# EAGLE design syringe board 1.4 (EAGLE 7.7.0)
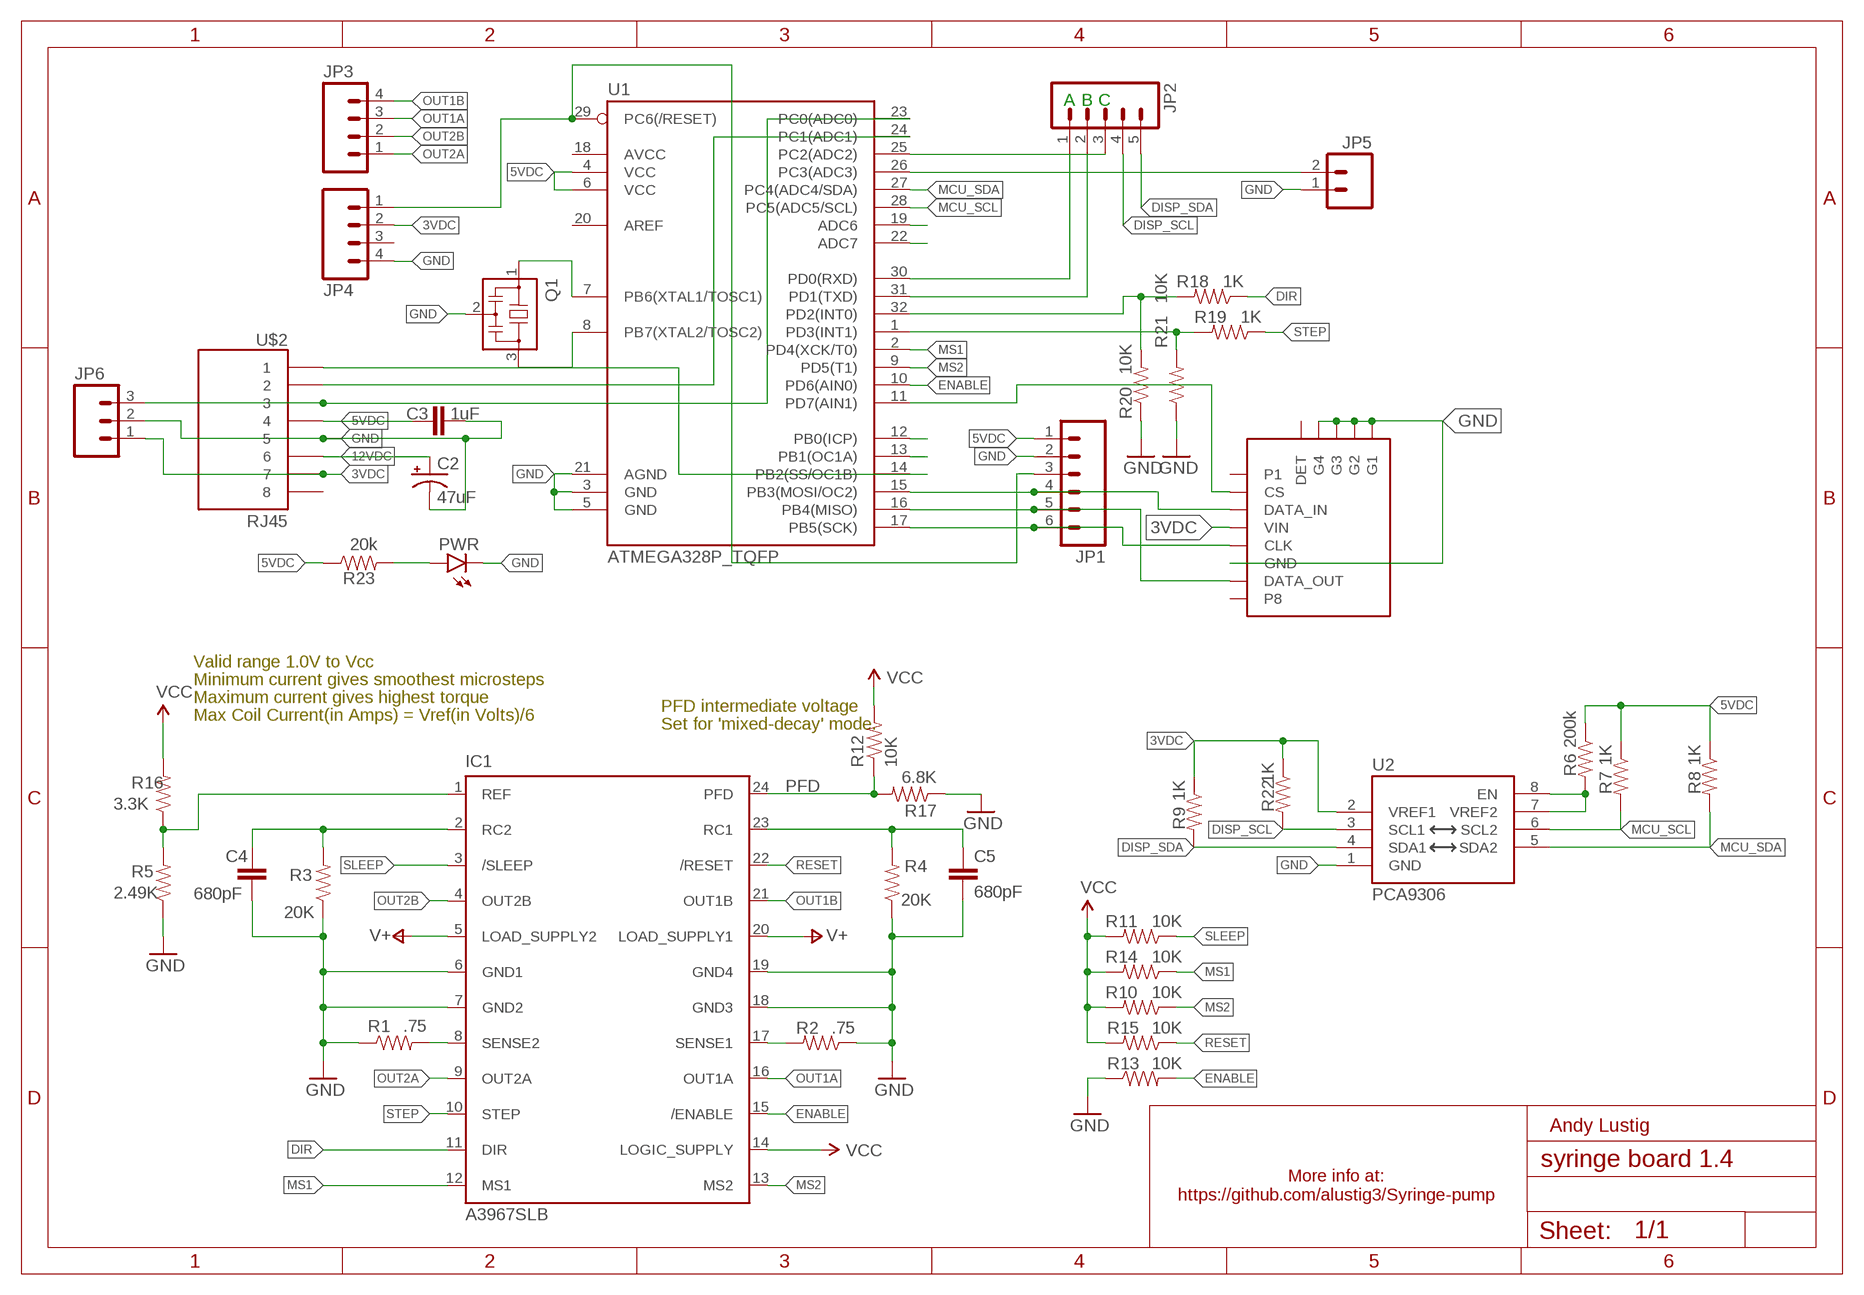
[diagram p0: schematic, sheet 1]

## Parts
C2  47uF  CPOL-USD  [PANASONIC_D]
C3  1uF  CAP0603-CAP  [0603-CAP]
C4  680pF  CAP0603-CAP  [0603-CAP]
C5  680pF  CAP0603-CAP  [0603-CAP]
IC1  A3967SLB  [SO24W]
JP1  M06NO_SILK_FEMALE_PTH  [1X06_NO_SILK]
JP2  M05NO_SILK  [1X05_NO_SILK]
JP3  M041X04_NO_SILK  [1X04_NO_SILK]
JP4  M04NO_SILK_ALL_ROUND  [1X04_NO_SILK_ALL_ROUND]
JP5  M021X02_NO_SILK  [1X02_NO_SILK]
JP6  M031X03_NO_SILK  [1X03_NO_SILK]
PWR  LED0603  [LED-0603]
Q1  RESONATOR_CSTCE_V  [CSTCE_V]
R1  .75  RESISTOR0805-RES  [0805]
R2  .75  RESISTOR0805-RES  [0805]
R3  20K  RESISTOR0603  [0603-RES]
R4  20K  RESISTOR0603  [0603-RES]
R5  2.49K  RESISTOR0603  [0603-RES]
R6  200k  RESISTOR0603  [0603-RES]
R7  1K  RESISTOR0603  [0603-RES]
R8  1K  RESISTOR0603  [0603-RES]
R9  1K  RESISTOR0603  [0603-RES]
R10  10K  RESISTOR0603  [0603-RES]
R11  10K  RESISTOR0603  [0603-RES]
R12  10K  RESISTOR0603  [0603-RES]
R13  10K  RESISTOR0603  [0603-RES]
R14  10K  RESISTOR0603  [0603-RES]
R15  10K  RESISTOR0603  [0603-RES]
R16  3.3K  RESISTOR0603  [0603-RES]
R17  6.8K  RESISTOR0603  [0603-RES]
R18  1K  RESISTOR0603  [0603-RES]
R19  1K  RESISTOR0603  [0603-RES]
R20  10K  RESISTOR0603  [0603-RES]
R21  10K  RESISTOR0603  [0603-RES]
R22  1K  RESISTOR0603  [0603-RES]
R23  20k  RESISTOR0603  [0603-RES]
U1  ATMEGA328P_TQFP  [TQFP32-08]
U2  PCA9306  [PSOP-8]
U$1  MICROSD_SOCKET  [MICROSD]
U$2  RJ45  [RJ45-8]

## Nets
3VDC: JP4.2 JP6.1 R9.1 R22.1 U2.2(VREF1) U$1.P4(VIN) U$2.7
5VDC: C3.1 IC1.14(LOGIC_SUPPLY) JP1.1 R6.1 R7.1 R8.1 R10.2 R11.2 R12.2 R14.2 R15.2 R16.2 R23.1 U1.4(VCC) U1.6(VCC) U$2.4 ; supply symbol labelled VCC
12VDC: C2.+ IC1.5(LOAD_SUPPLY2) IC1.20(LOAD_SUPPLY1) U$2.6 ; supply symbol labelled V+
DIR: IC1.11(DIR) R18.1
DIR_IN: R18.2 R20.2 U1.32(PD2(INT0))
DISP_SCL: JP2.4 R22.2 U2.3(SCL1)
DISP_SDA: JP2.5 R9.2 U2.4(SDA1)
ENABLE: IC1.15(/ENABLE) R13.2 U1.10(PD6(AIN0))
GND: C2.- C3.2 C4.2 C5.2 IC1.6(GND1) IC1.7(GND2) IC1.18(GND3) IC1.19(GND4) JP1.2 JP4.4 JP5.1 JP6.2 PWR.C Q1.2 R1.1 R2.1 R3.1 R4.1 R5.1 R13.1 R17.1 R20.1 R21.1 U1.3(GND) U1.5(GND) U1.21(AGND) U2.1(GND) U$1.G1 U$1.G2 U$1.G3 U$1.G4 U$1.P6(GND) U$2.5
MCU_SCL: R7.2 U1.28(PC5(ADC5/SCL)) U2.6(SCL2)
MCU_SDA: R8.2 U1.27(PC4(ADC4/SDA)) U2.5(SDA2)
MISO: JP1.5 U1.16(PB4(MISO)) U$1.P7(DATA_OUT)
MOSI: JP1.4 U1.15(PB3(MOSI/OC2)) U$1.P3(DATA_IN)
MS1: IC1.12(MS1) R14.1 U1.2(PD4(XCK/T0))
MS2: IC1.13(MS2) R10.1 U1.9(PD5(T1))
N$1: IC1.8(SENSE2) R1.2
N$2: Q1.1 U1.7(PB6(XTAL1/TOSC1))
N$3: IC1.17(SENSE1) R2.2
N$4: Q1.3 U1.8(PB7(XTAL2/TOSC2))
N$5: C4.1 IC1.2(RC2) R3.2
N$6: R6.2 U2.7(VREF2) U2.8(EN)
N$7: C5.1 IC1.23(RC1) R4.2
N$8: PWR.A R23.2
N$9: U1.11(PD7(AIN1)) U$1.P2(CS)
N$11: U1.13(PB1(OC1A))
N$12: JP6.3 U1.23(PC0(ADC0)) U$2.3
N$13: U1.12(PB0(ICP))
N$14: U1.22(ADC7)
N$15: JP2.1 U1.30(PD0(RXD))
N$16: JP2.2 U1.31(PD1(TXD))
N$17: JP2.3 U1.25(PC2(ADC2))
N$18: U1.19(ADC6)
N$19: JP5.2 U1.26(PC3(ADC3))
N$20: U1.24(PC1(ADC1)) U$2.2
N$21: U1.14(PB2(SS/OC1B)) U$2.1
OUT1A: IC1.16(OUT1A) JP3.3
OUT1B: IC1.21(OUT1B) JP3.4
OUT2A: IC1.9(OUT2A) JP3.1
OUT2B: IC1.4(OUT2B) JP3.2
PFD: IC1.24(PFD) R12.1 R17.2
RESET: IC1.22(/RESET) R15.1
RST: JP1.3 JP4.1 U1.29(PC6(/RESET))
SCK: JP1.6 U1.17(PB5(SCK)) U$1.P5(CLK)
SLEEP: IC1.3(/SLEEP) R11.1
STEP: IC1.10(STEP) R19.1
STEP_IN: R19.2 R21.2 U1.1(PD3(INT1))
VREF: IC1.1(REF) R5.2 R16.1
Unconnected: JP4.3 U1.18(AVCC) U1.20(AREF) U$1.G5(DET) U$1.P1 U$1.P8 U$2.8

## Notes on the sheet
- A | B | C
- Valid range 1.0V to Vcc
- Minimum current gives smoothest microsteps
- Maximum current gives highest torque
- PFD intermediate voltage
- Max Coil Current(in Amps) = Vref(in Volts)/6
- Set for 'mixed-decay' mode.
- Andy Lustig
- More info at:
  https://github.com/alustig3/Syringe-pump

## Library data of the parts
C2 = adafruit:CPOL-US: POLARIZED CAPACITOR, American symbol
C3-C5 = SparkFun-Capacitors:CAP: Capacitor Standard 0603 ceramic capacitor, and 0.1" leaded capacitor.
IC1 = Allegro:A3967SLB: ANALOG DEVICES
JP1 = SparkFun-Connectors:M06: Header 6 Standard 6-pin 0.1" header. Use with straight break away headers (SKU : PRT-00116), right angle break away headers (PRT-00553), swiss pins (PRT-00743), machine pins (PRT-00117), and female headers (PRT-00115). Molex polarized connector foot print use with SKU : PRT-08094 with associated crimp pins and housings. NOTES ON THE VARIANTS LOCK and LOCK_LONGPADS... This footprint was designed to help hold the alignment of a through-hole component (i.e. 6-pin header) while soldering it into place. You may notice that each hole has been shifted either up or down by 0.005 of an inch from it's more standard position (which is a perfectly straight line). This slight alteration caused the pins (the squares in the middle) to touch the edges of the holes. Because they are alternating, it causes a "brace" to hold the component in place. 0.005 has proven to be the perfect amount of "off-center" position when using our standard breakaway headers. Although looks a little odd when you look at the bare footprint, once you have a header in there, the alteration is very hard to notice. Also,if you push a header all the way into place, it is covered up entirely on the bottom side. This idea of altering the position of holes to aid alignment will be further integrated into the Sparkfun Library for other footprints. It can help hold any component with 3 or more connection pins.; PROD_ID: CONN-08437
JP2 = SparkFun-Connectors:M05: Header 5 Standard 5-pin 0.1" header. Use with straight break away headers (SKU : PRT-00116), right angle break away headers (PRT-00553), swiss pins (PRT-00743), machine pins (PRT-00117), and female headers (PRT-00115). Molex polarized connector foot print use with SKU : PRT-08230 with associated crimp pins and housings.
JP3 = SparkFun:M04: Header 4 Standard 4-pin 0.1" header. Use with straight break away headers (SKU : PRT-00116), right angle break away headers (PRT-00553), swiss pins (PRT-00743), machine pins (PRT-00117), and female headers (PRT-00115). Molex polarized connector foot print use with SKU : PRT-08231 with associated ...
JP4 = SparkFun-Connectors:M04: Header 4 Standard 4-pin 0.1" header. Use with straight break away headers (SKU : PRT-00116), right angle break away headers (PRT-00553), swiss pins (PRT-00743), machine pins (PRT-00117), and female headers (PRT-00115). Molex polarized connector foot print use with SKU : PRT-08231 with associated ...
JP5 = SparkFun-Connectors:M02: Standard 2-pin 0.1" header. Use with - straight break away headers ( PRT-00116) - right angle break away headers (PRT-00553) - swiss pins (PRT-00743) - machine pins (PRT-00117) - female headers (PRT-00115) Molex polarized connector foot print use with: PRT-08233 with associated crimp pins and housings. 2.54_SCREWTERM for use with PRT-10571. 3.5mm Screw Terminal footprints for PRT-08084 5mm Screw Terminal footprints for use with PRT-08432
JP6 = SparkFun-Connectors:M03: Header 3 Standard 3-pin 0.1" header. Use with straight break away headers (SKU : PRT-00116), right angle break away headers (PRT-00553), swiss pins (PRT-00743), machine pins (PRT-00117), and female headers (PRT-00115). Molex polarized connector foot print use with SKU : PRT-08232 with associated crimp pins and housings.
PWR = Andy-library:LED: LEDs Standard schematic elements and footprints for 5mm, 3mm, 1206, and 0603 sized LEDs. 5mm - Spark Fun Electronics SKU : COM-00529 (and others)
Q1 = Andy-library:RESONATOR: 16 MHz Resonator(Murata p/n CSTCE16M0V53-R0) Digikey: 490-1198-1-ND <http://www.digikey.com/product-search/en?keywords=490-1198-1-nd>
R1-R23 = SparkFun-Resistors:RESISTOR: Resistor Basic schematic elements and footprints for 0603, 1206, and PTH resistors.
U1 = SparkFun-DigitalIC:ATMEGA328P_TQFP; PROD_ID: IC-09069
U2 = SparkFun-DigitalIC:PCA9306: Bidirectional I2C level shifter. NOT compatible with all available part number pinout schemes- DOUBLE CHECK!!!; PROD_ID: IC-10023
U$1 = Andy-library:MICROSD_SOCKET: Molex push-pull micro SD card connector Digikey: WM9731CT-ND <http://www.digikey.com/product-search/en?keywords=wm9731ct>
U$2 = Andy-library:RJ45

## Board
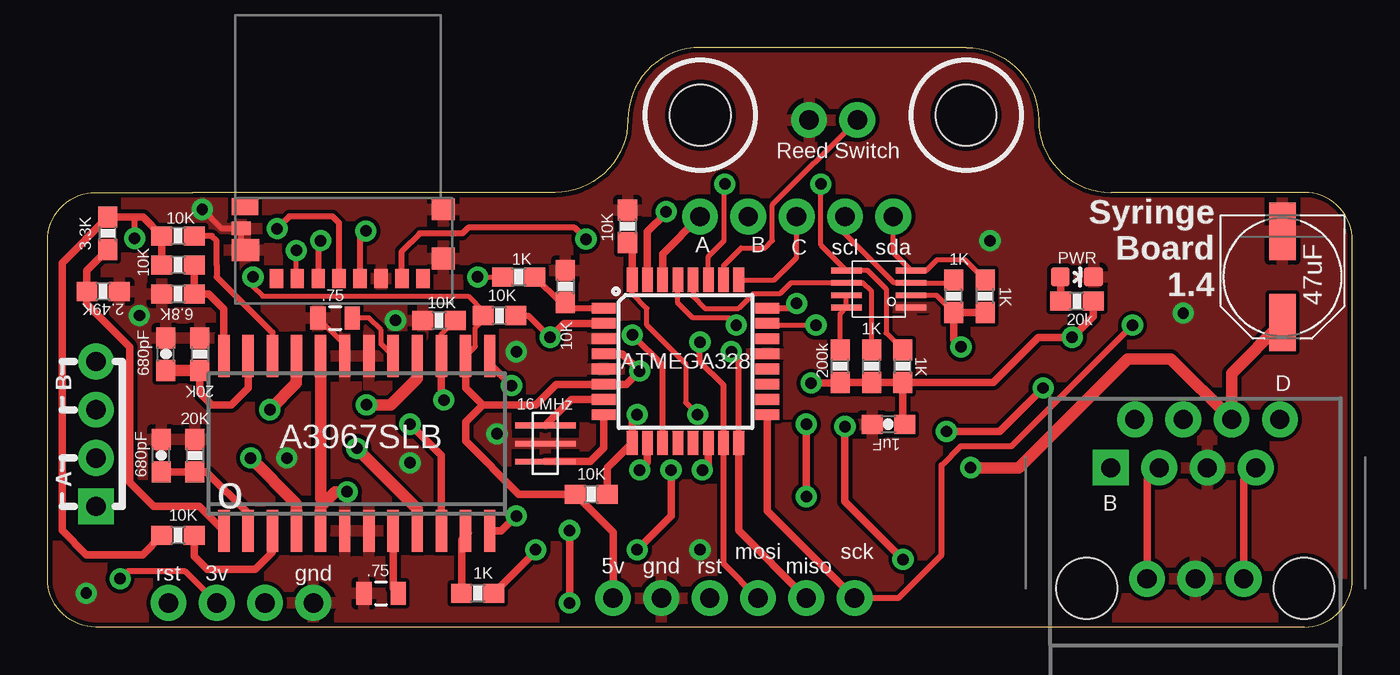
[diagram p1: board, top side]
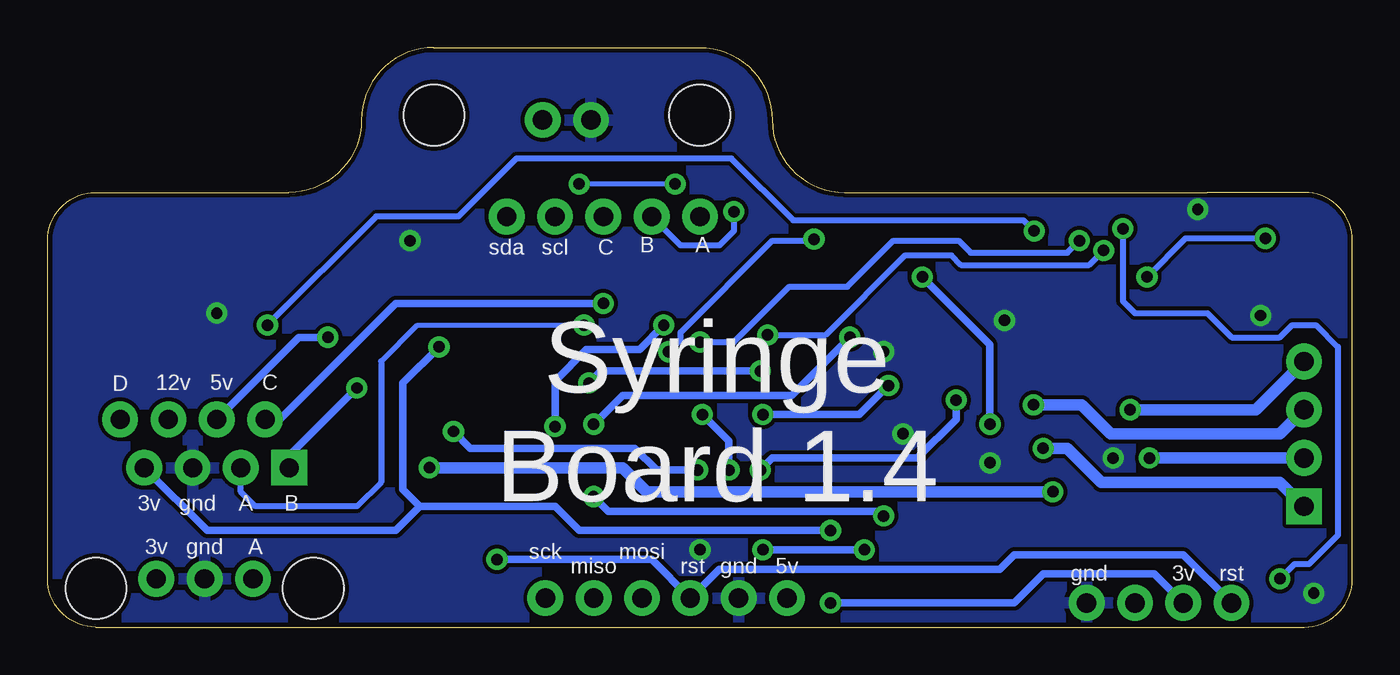
[diagram p2: board, bottom side, seen from below]

Size 68.58 x 30.48 mm. Coordinates in mm from the lower left corner, seen from the top.
Outline: 7.64,22.86 26.68,22.86 arc90 30.5,26.67 arc-90 34.3,30.48 48.27,30.48 arc-90 52.09,26.67 arc90 55.9,22.86 66.04,22.86 arc-90 68.58,20.32 68.58,2.54 arc-90 66.04,0 2.54,0 arc-90 0,2.54 0,20.32 arc-90 2.54,22.86 7.62,22.86
Copper layers (1*16): Top 0.035mm / dielectric 1.5mm / Bottom 0.035mm
Design rules "GoldPhoenix_8and8": minimum track width 7mil, minimum drill 15mil, track to track 8mil, track to pad 8mil, pad to pad 8mil, via to via 8mil, smd to smd 8mil, copper to edge 10mil, drill to drill 8mil, minimum pad ring 12mil, minimum via ring 10mil, stop-mask expansion 4mil, vias tented up to drill 25mil, thermal gap 10mil
Holes 3.2 mm at 34.3,26.92 48.27,26.92

### Footprints (pad centres in the part's own frame; a part is rotated, then mirrored left to right if it is on the bottom)
PANASONIC_D = smd 3 x 1.4: + 2.4,0; - -2.4,0
0603-CAP = smd 1.1 x 1: 1 -0.85,0; 2 0.85,0
SO24W = smd 0.6 x 2.2: 1 -6.985,-4.6; 2 -5.715,-4.6; 3 -4.445,-4.6; 4 -3.175,-4.6; 5 -1.905,-4.6; 6 -0.635,-4.6; 7 0.635,-4.6; 8 1.905,-4.6; 9 3.175,-4.6; 10 4.445,-4.6; 11 5.715,-4.6; 12 6.985,-4.6; 13 6.985,4.6; 14 5.715,4.6; 15 4.445,4.6; 16 3.175,4.6; 17 1.905,4.6; 18 0.635,4.6; 19 -0.635,4.6; 20 -1.905,4.6; 21 -3.175,4.6; 22 -4.445,4.6; 23 -5.715,4.6; 24 -6.985,4.6
1X06_NO_SILK = drill 1.016 pad 1.88: 1 0,0; 2 2.54,0; 3 5.08,0; 4 7.62,0; 5 10.16,0; 6 12.7,0
1X05_NO_SILK = drill 1.016 pad 1.88: 1 0,0; 2 2.54,0; 3 5.08,0; 4 7.62,0; 5 10.16,0
1X04_NO_SILK = drill 1.016 pad 1.88 square: 1 0,0 | drill 1.016 pad 1.88: 2 2.54,0; 3 5.08,0; 4 7.62,0
1X04_NO_SILK_ALL_ROUND = drill 1.016 pad 1.88: 1 0,0; 2 2.54,0; 3 5.08,0; 4 7.62,0
1X02_NO_SILK = drill 1.016 pad 1.88: 1 0,0; 2 2.54,0
1X03_NO_SILK = drill 1.016 pad 1.88: 1 0,0; 2 2.54,0; 3 5.08,0
LED-0603 = smd 1 x 1: A 0,-0.877; C 0,0.877
CSTCE_V = smd 0.3 x 3.175: 1 -0.95,0; 2 0,0; 3 0.95,0
0805 = smd 0.8 x 1.2: 1 -0.9,0; 2 0.9,0
0603-RES = smd 1.1 x 1: 1 -0.85,0; 2 0.85,0
TQFP32-08 = smd 1.27 x 0.559: 1 -4.293,2.8; 2 -4.293,2; 3 -4.293,1.2; 4 -4.293,0.4; 5 -4.293,-0.4; 6 -4.293,-1.2; 7 -4.293,-2; 8 -4.293,-2.8; 17 4.293,-2.8; 18 4.293,-2; 19 4.293,-1.2; 20 4.293,-0.4; 21 4.293,0.4; 22 4.293,1.2; 23 4.293,2; 24 4.293,2.8 | smd 0.559 x 1.27: 9 -2.8,-4.293; 10 -2,-4.293; 11 -1.2,-4.293; 12 -0.4,-4.293; 13 0.4,-4.293; 14 1.2,-4.293; 15 2,-4.293; 16 2.8,-4.293; 25 2.8,4.293; 26 2,4.293; 27 1.2,4.293; 28 0.4,4.293; 29 -0.4,4.293; 30 -1.2,4.293; 31 -2,4.293; 32 -2.8,4.293
PSOP-8 = smd 0.3 x 1.6: 1 -0.975,-1.7; 2 -0.325,-1.7; 3 0.325,-1.7; 4 0.975,-1.7; 5 0.975,1.7; 6 0.325,1.7; 7 -0.325,1.7; 8 -0.975,1.7
MICROSD = smd 1.2 x 1.15: G1 -4.925,-2.36; G2 -4.925,-4.95 | smd 1.45 x 1.15: G3 5.475,-2.8 | smd 1 x 0.7: G4 5.7,-3.95 | smd 1.4 x 0.9: G5 5.5,-5.1 | smd 0.7 x 1: P1 3.85,-1.31; P2 2.75,-1.31; P3 1.65,-1.31; P4 0.55,-1.31; P5 -0.55,-1.31; P6 -1.65,-1.31; P7 -2.75,-1.31; P8 -3.85,-1.31
RJ45-8 = drill 1 pad 1.88 square: 1 -4.445,6.35 | drill 1 pad 1.88: 2 -3.175,8.89; 3 -1.905,6.35; 4 -0.635,8.89; 5 0.635,6.35; 6 1.905,8.89; 7 3.175,6.35; 8 4.445,8.89 | hole 3.2: -5.715,0; 5.715,0

### Placement (x,y rotation side)
C2  64.9,18.41 270 top
C3  44.2,10.67 180 top
C4  5.97,9.02 90 top
C5  6.22,14.35 90 top
IC1  16.26,9.65 0 top
JP1  29.72,1.52 0 top
JP2  34.29,21.59 0 top
JP3  2.54,6.35 90 top
JP4  6.35,1.27 0 top
JP5  40.02,26.67 0 top
JP6  62.87,2.54 180 top
PWR  54.1,18.41 270 top
Q1  26.16,9.65 270 top
R1  17.53,1.78 0 top
R2  15.11,16.26 0 top
R3  7.75,9.02 270 top
R4  8,14.35 270 top
R5  2.92,17.65 180 top
R6  41.66,13.72 90 top
R7  43.31,13.72 90 top
R8  44.96,13.72 90 top
R9  49.28,17.4 90 top
R10  28.57,6.99 180 top
R11  6.86,4.83 180 top
R12  6.86,19.05 180 top
R13  20.57,16.13 0 top
R14  23.75,16.38 180 top
R15  6.86,20.57 180 top
R16  3.17,20.7 90 top
R17  6.86,17.53 0 top
R18  22.61,1.78 0 top
R19  24.77,18.41 0 top
R20  30.48,21.08 270 top
R21  27.21,17.91 270 top
R22  47.62,17.4 90 top
R23  54.1,17.14 180 top
U1  33.53,13.97 0 top
U2  43.69,17.78 90 top
U$1  15.88,17.02 180 top
U$2  60.33,2.03 0 top

### Tracks (layer width: path | path; a pad name or v marks a point on that pad's centre or on a via)
3VDC  (via drill 0.6)
  Top 0.254: U2.2 46.72,17.45 R22.1
  Top 0.305: U$1.P4 15.32,21.25 14.99,21.59 12.7,21.59 v12.06,20.95 | v3.81,2.54 4.19,2.92 7.24,2.92 JP4.2
  Top 0.406: v27.43,1.27 v27.43,5.08 | R9.1 R22.1 47.62,15.11 v48.01,14.73 | JP6.1 62.87,7.75 U$2.7
  Bottom 0.305: v12.06,20.95 12.06,17.14 11.43,16.51 7.62,16.51 6.35,15.24 3.81,15.24 3.17,15.88 1.91,15.88 0.76,14.73 0.76,4.83 2.29,3.3 3.05,3.3 v3.81,2.54
  Bottom 0.406: JP4.2 10.41,2.79 16.26,2.79 17.78,1.27 v27.43,1.27 | v27.43,5.08 40.64,5.08 41.91,6.35 49.02,6.35 | 49.02,6.35 49.91,7.24 49.91,12.83 v48.01,14.73 | 49.02,6.35 50.29,5.08 60.2,5.08 U$2.7
5VDC  (via drill 0.6)
  Top 0.254: IC1.14 22.48,14.76 22.48,15.75 22.9,16.17 R14.2 22.9,16.6 22.1,17.4 11.3,17.4 10.79,17.91 v10.79,18.41
  Top 0.305: v4.57,20.45 4.57,21.55 5.03,21.55
  Top 0.406: R8.1 R7.1 R6.1 41.62,12.83 v40.13,12.83 | 22.86,11.68 25.65,11.68 26.74,12.77 U1.6 30.42,12.77 v31.11,13.46 30.21,14.37 U1.4 | 22.86,11.68 21.97,10.79 21.97,9.78 24.77,6.99 R10.2 29.72,4.99 JP1.1 | 22.86,11.68 21.97,12.57 IC1.14 | R11.2 4.99,3.81 2.03,3.81 0.76,5.08 0.76,19.14 R16.2 5.03,21.55 R15.2 R12.2 | R8.1 44.96,10.76 C3.1 | R8.1 49.7,12.87 52.07,15.24 v53.85,15.24 54.95,16.34 R23.1
  Bottom 0.305: v10.79,18.41 8.76,20.45 v4.57,20.45
  Bottom 0.406: v53.85,15.24 55.37,15.24 U$2.4 | v31.11,13.46 39.5,13.46 v40.13,12.83
12VDC  (via drill 0.6)
  Top 0.406: 14.35,6.73 14.35,6.35
  Top 0.61: IC1.5 14.35,6.35 15.11,7.11 v15.75,7.11 | 14.35,6.73 IC1.20 | v48.51,8.38 51.05,8.38 56.78,14.11 59.04,14.11 U$2.6 62.23,13.35 C2.+
  Bottom 0.61: v15.75,7.11 37.08,7.11 38.35,8.38 v48.51,8.38
DIR
  Top 0.406: IC1.11 22.1,4.92 21.76,4.58 R18.1
DIR_IN  (via drill 0.6)
  Top 0.254: U1.32 30.73,17.53 31.5,16.76 31.5,15.88 33.53,13.84 33.53,11.81 v34.16,11.18
  Top 0.406: U1.32 30.73,19.98 R20.2 | v25.65,4.06 25.65,3.98 R18.2 | v30.99,4.06 32.77,5.84 v32.77,8.26
  Bottom 0.406: v25.65,4.06 v30.99,4.06 | v32.77,8.26 32.77,9.78 v34.16,11.18
DISP_SCL
  Top 0.254: JP2.4 41.91,20.7 44.51,18.11 U2.3 47.62,18.11 R22.2
DISP_SDA
  Top 0.254: JP2.5 44.45,19.69 U2.4 46.19,18.75 46.74,19.3 48.22,19.3 R9.2
ENABLE  (via drill 0.6)
  Top 0.254: IC1.15 20.7,15.41 R13.2
  Top 0.406: IC1.15 20.7,12.06 v20.83,11.94 | U1.10 31.53,8.67 v31.11,8.26
  Bottom 0.406: v20.83,11.94 20.83,10.92 22.86,8.89 30.48,8.89 v31.11,8.26
GND  (via drill 0.6)
  Top 0.254: IC1.19 15.62,14.85 R2.1 | U$1.G3 10.18,20.04
  Top 0.305: 10.18,20.04 U$1.G4 9.13,20.97 v8.13,21.97
  other vias: 23.62,10.16 24.64,14.48 19.05,8.64 4.83,16.38 34.29,4.06 2.03,1.78 59.69,16.51 49.53,20.32 18.29,16.13 12.57,8.89
  pour Bottom: 0,32 68.71,31.88 68.58,0 0,0
  pour Top: -0.02,31.94 68.69,31.81 68.58,0 0,0
MCU_SCL
  Top 0.254: U1.28 33.93,17.38 34.54,16.76 36.32,16.76 37.08,17.53 38.48,17.53 39.06,18.11 U2.6 42.85,18.11 43.31,17.65 R7.2
MCU_SDA  (via drill 0.6)
  Top 0.254: U1.27 34.73,19.49 35.56,20.32 35.56,23.26 v35.6,23.3 | R8.2 44.07,15.46 44.07,17.78 43.09,18.75 U2.5 40.64,20.1 v40.64,23.3
  Bottom 0.254: v35.6,23.3 v40.64,23.3
MISO  (via drill 0.6)
  Top 0.305: U$1.P7 18.62,19.77 19.56,20.7 21.8,20.7 22.1,21 27.7,21 v28.3,20.4 | U1.16 36.33,14.09 v35.94,14.48
  Top 0.406: JP1.5 36.33,5.07 U1.16
  Bottom 0.305: v35.94,14.48 35.31,15.11 35.31,15.49 30.48,20.32 28.38,20.32 v28.3,20.4
MOSI  (via drill 0.6)
  Top 0.305: JP1.4 35.53,3.33 U1.15 35.53,12.73 34.29,13.97 v34.29,14.99 | v14.35,20.32 14.22,20.19 U$1.P3
  Bottom 0.305: v34.29,14.99 32.51,14.99 29.59,17.91 26.54,17.91 24.13,20.32 20.7,20.32 20.07,19.68 14.99,19.68 v14.35,20.32
MS1  (via drill 0.6)
  Top 0.305: R14.1 25.27,16.38 v26.42,15.24
  Top 0.406: v39.88,10.67 v39.88,6.86 | U1.2 27.15,15.97 v26.42,15.24 | IC1.12 23.85,5.05 v24.64,5.84
  Bottom 0.406: v24.64,5.84 24.89,6.1 39.12,6.1 v39.88,6.86 | v26.42,15.24 29.46,12.19 38.35,12.19 v39.88,10.67
MS2  (via drill 0.6)
  Top 0.406: v30.99,11.18 30.73,10.92 U1.9 29.43,8.37 R10.1 | v24.38,12.7 23.24,13.84 IC1.13
  Bottom 0.406: v24.38,12.7 25.91,11.18 v30.99,11.18
N$1
  Top 0.406: R1.2 18.16,2.04 IC1.8
N$2
  Top 0.406: U1.7 27.53,11.97 Q1.1
N$3
  Top 0.254: IC1.17 17.53,14.89 17.53,15.62 16.89,16.26 R2.2
N$4
  Top 0.406: U1.8 29.23,9.42 28.51,8.7 Q1.3
N$5
  Top 0.406: C4.1 R3.2 8.34,8.17 10.54,5.97 IC1.2
N$6
  Top 0.254: U2.7 U2.8 41.66,16.47 R6.2
N$7
  Top 0.406: IC1.23 10.54,12.57 9.65,11.68 8.64,11.68 8,12.32 R4.2
  Top 0.61: C5.1 R4.2
N$8
  Top 0.406: R23.2 53.25,18.39 PWR.A
N$9  (via drill 0.6)
  Top 0.254: U$1.P2 13.08,18.37 v13.08,19.81
  Top 0.305: U1.11 32.33,13.77 v30.73,15.37
  Bottom 0.305: v30.73,15.37 27.69,15.37 23.5,19.56 21.08,19.56 20.57,19.05 13.84,19.05 v13.08,19.81
N$12  (via drill 0.6)
  Top 0.254: U1.23 37.92,15.88 v40.39,15.88
  Top 0.406: JP6.3 57.78,7.75 U$2.3
  Bottom 0.254: 51.05,13.97 49.15,15.88 v40.39,15.88
  Bottom 0.305: 51.05,13.97 51.05,7.62 52.32,6.35 57.66,6.35 58.42,7.11 U$2.3
N$15
  Top 0.406: U1.30 32.33,19.63 JP2.1
N$16  (via drill 0.6)
  Top 0.406: U1.31 31.53,20.8 32.51,21.78 v32.51,21.84
  Bottom 0.305: v32.51,21.84 32.51,20.83 33.27,20.07 35.31,20.07 JP2.2
N$17
  Top 0.254: U1.25 38.2,18.26 39.37,19.43 JP2.3
N$19
  Top 0.254: U1.26 35.53,19.02 36.45,19.94 37.72,19.94 38.1,20.32 38.1,22.21 JP5.2
N$20  (via drill 0.6)
  Top 0.305: U1.24 39.12,16.77 v39.37,17.02
  Bottom 0.406: v39.37,17.02 50.29,17.02 56.39,10.92 U$2.2
N$21  (via drill 0.6)
  Top 0.406: U1.14 34.73,8.57 v34.42,8.26 | v47.24,10.29 50.04,10.29 v52.32,12.57
  Bottom 0.406: v34.42,8.26 36.58,8.26 37.72,9.4 46.35,9.4 v47.24,10.29 | v52.32,12.57 55.88,9.02 U$2.1
OUT1A  (via drill 0.6)
  Top 0.61: IC1.16 19.43,13.08 18.03,11.68 v16.76,11.68
  Bottom 0.61: JP3.3 3.81,10.16 12.7,10.16 14.22,11.68 v16.76,11.68
OUT1B  (via drill 0.6)
  Top 0.61: v11.68,11.43 13.08,12.83 IC1.21
  Bottom 0.61: JP3.4 5.08,11.43 v11.68,11.43
OUT2A  (via drill 0.6)
  Top 0.61: v16.26,9.4 19.43,6.22 IC1.9
  Bottom 0.61: JP3.1 3.81,7.62 13.21,7.62 14.99,9.4 v16.26,9.4
OUT2B  (via drill 0.6)
  Top 0.61: IC1.4 13.08,6.48 v10.67,8.89
  Bottom 0.61: JP3.2 v10.67,8.89
PFD
  Top 0.406: IC1.24 9.27,16.73 8.47,17.53 R17.2 R12.1
RESET
  Top 0.305: R15.1 8.64,20.57 8.89,20.32 8.89,19.05 8.89,18.41 11.81,15.49 IC1.22
RST  (via drill 0.6)
  Top 0.254: v36.2,15.88 35.81,16.26 33.91,16.26 33.13,17.04 U1.29
  Top 0.406: v44.96,3.56 41.91,6.6 v41.91,10.54
  Bottom 0.406: JP4.1 8.89,3.81 17.78,3.81 18.54,3.05 33.27,3.05 JP1.3 36.83,3.56 v44.96,3.56 | v41.91,10.54 41.91,12.95 40.26,14.61 37.47,14.61 v36.2,15.88
SCK  (via drill 0.6)
  Top 0.305: JP1.6 44.7,1.52 46.99,3.81 46.99,8.51 48.01,9.53 50.67,9.53 v57.02,15.88 | U$1.P5 16.43,20.53 v16.73,20.83
  Top 0.406: JP1.6 37.82,6.12 U1.17
  Bottom 0.305: v57.02,15.88 51.31,21.59 46.99,21.59 43.94,24.64 32.64,24.64 29.4,21.4 17.3,21.4 v16.73,20.83
SLEEP
  Top 0.406: IC1.3 11.81,3.94 10.92,3.05 8.38,3.05 7.71,3.72 R11.1
STEP  (via drill 0.6)
  Top 0.254: v22.61,18.41 R19.1
  Top 0.406: IC1.10 20.7,9.02 v19.05,10.67
  Bottom 0.406: v19.05,10.67 19.05,13.97 19.05,14.86 v22.61,18.41
STEP_IN
  Top 0.305: R19.2 26.97,17.06 R21.2 27.5,16.77 U1.1
VREF
  Top 0.406: IC1.1 7.97,6.35 5.59,6.35 4.32,7.62 4.32,14.73 2.07,16.98 R5.2 2.07,18.75 R16.1

### Text on the board
tPlace: B | A
tNames: Reed Switch | A | B | C | scl | sda | Syringe / Board / 1.4 | ATMEGA328 | D | 16 MHz | o | B | mosi | sck | 5v | gnd | rst | miso | rst | 3v | gnd
bNames: A | B | C | scl | sda | C | 5v | 12v | D | Syringe / Board 1.4 | B | A | gnd | 3v | mosi | sck | A | gnd | 3v | 5v | gnd | rst | miso | rst | 3v | gnd